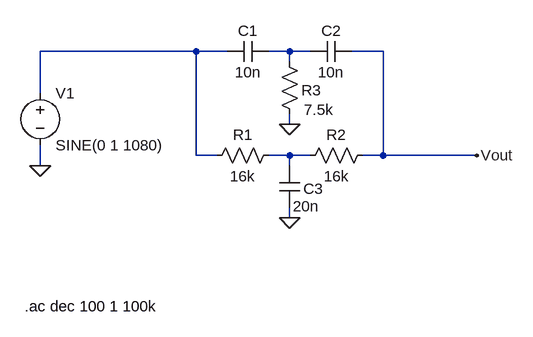
[diagram p0: schematic Twin_T_Filter.asc]
Twin_T_Filter.asc, the LTspice schematic file:
Version 4
SHEET 1 1712 1132
WIRE 800 -176 560 -176
WIRE 848 -176 800 -176
WIRE 944 -176 912 -176
WIRE 976 -176 944 -176
WIRE 1088 -176 1040 -176
WIRE 944 -160 944 -176
WIRE 560 -112 560 -176
WIRE 944 -64 944 -80
WIRE 800 -16 800 -176
WIRE 832 -16 800 -16
WIRE 944 -16 912 -16
WIRE 976 -16 944 -16
WIRE 1088 -16 1088 -176
WIRE 1088 -16 1056 -16
WIRE 1232 -16 1088 -16
WIRE 560 0 560 -32
WIRE 944 0 944 -16
WIRE 944 80 944 64
FLAG 1232 -16 Vout
FLAG 560 0 0
FLAG 944 -64 0
FLAG 944 80 0
SYMBOL res 928 -32 R90
WINDOW 0 0 56 VBottom 2
WINDOW 3 32 56 VTop 2
SYMATTR InstName R1
SYMATTR Value 16k
SYMBOL res 1072 -32 R90
WINDOW 0 0 56 VBottom 2
WINDOW 3 32 56 VTop 2
SYMATTR InstName R2
SYMATTR Value 16k
SYMBOL res 960 -64 R180
WINDOW 0 -33 52 Left 2
WINDOW 3 -52 22 Left 2
SYMATTR InstName R3
SYMATTR Value 7.5k
SYMBOL voltage 560 -128 R0
SYMATTR InstName V1
SYMATTR Value SINE(0 1 1080)
SYMATTR Value2 AC 1
SYMBOL cap 912 -192 R90
WINDOW 0 0 32 VBottom 2
WINDOW 3 32 32 VTop 2
SYMATTR InstName C1
SYMATTR Value 10n
SYMATTR SpiceLine mfg="   ---" pn="   ---" type="   ---"
SYMBOL cap 1040 -192 R90
WINDOW 0 0 32 VBottom 2
WINDOW 3 32 32 VTop 2
SYMATTR InstName C2
SYMATTR Value 10n
SYMATTR SpiceLine mfg="   ---" pn="   ---" type="   ---"
SYMBOL cap 960 64 R180
WINDOW 0 -36 29 Left 2
WINDOW 3 -30 2 Left 2
SYMATTR InstName C3
SYMATTR Value 20n
SYMATTR SpiceLine mfg="   ---" pn="   ---" type="   ---"
TEXT 536 216 Left 2 !.ac dec 100 1 100k

The netlist it stands for:
* Twin_T_Filter.asc
R1 N003 N001 16k
R2 Vout N003 16k
R3 0 N002 7.5k
V1 N001 0 SINE(0 1 1080) AC 1
C1 N002 N001 10n mfg="   ---" pn="   ---" type="   ---"
C2 Vout N002 10n mfg="   ---" pn="   ---" type="   ---"
C3 0 N003 20n mfg="   ---" pn="   ---" type="   ---"
.ac dec 100 1 100k
.backanno
.end